# Altium schematic sheet STM32_MCU.SchDoc
size A; SheetNumber: 3; SheetTotal: 4
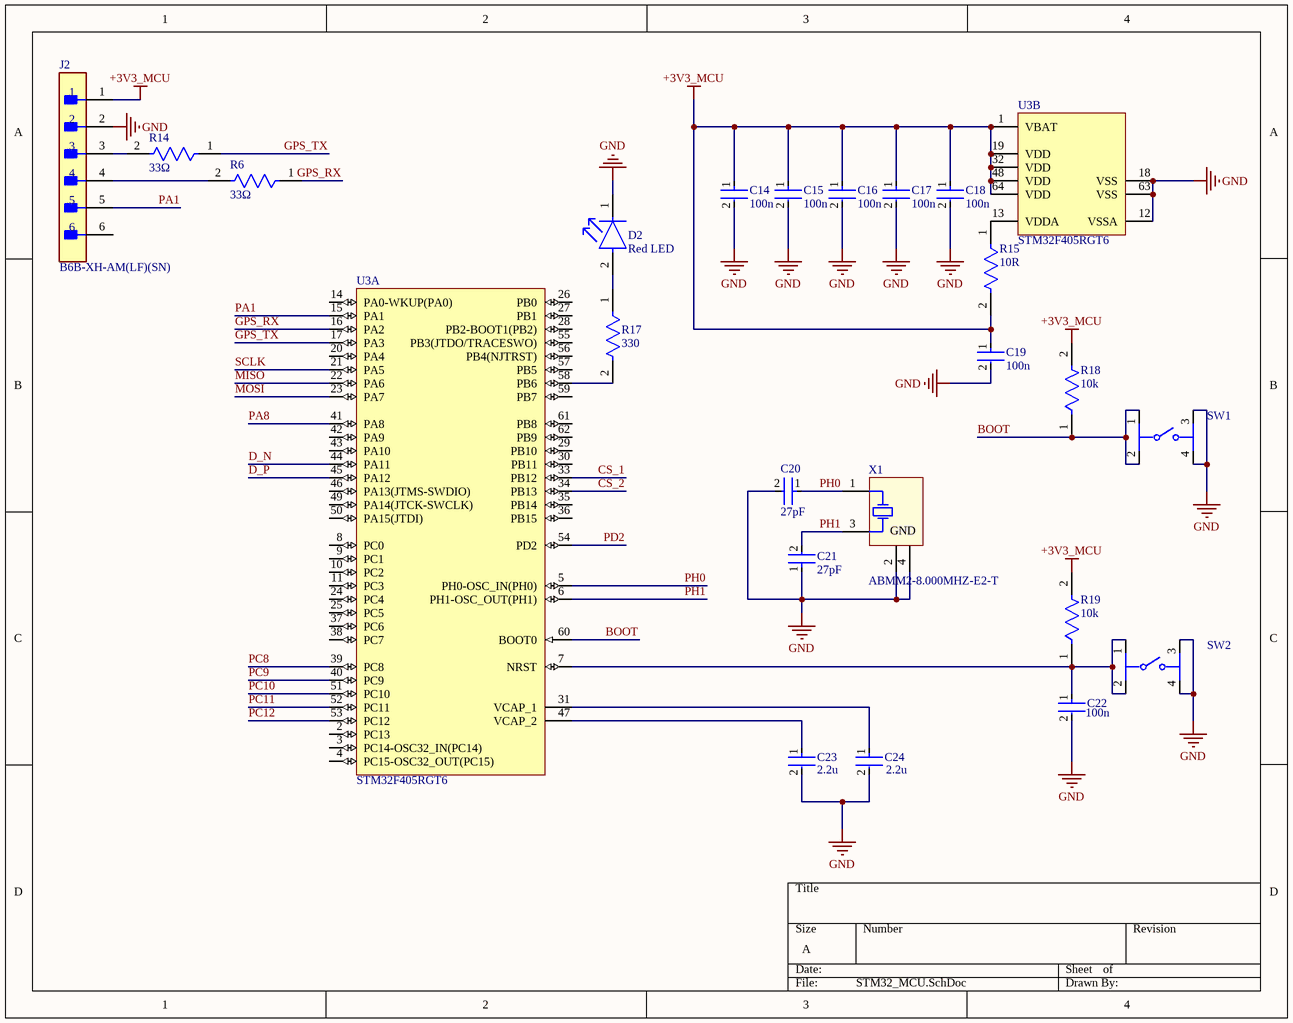
[diagram p0: STM32_MCU.SchDoc]

## Parts
C14  Capacitance: 100n  [FP-0603B104K250CT-IPC_C]  (hidden comment: 0603B104K250CT)
C15  Capacitance: 100n  [FP-0603B104K250CT-IPC_C]  (hidden comment: 0603B104K250CT)
C16  Capacitance: 100n  [FP-0603B104K250CT-IPC_C]  (hidden comment: 0603B104K250CT)
C17  Capacitance: 100n  [FP-0603B104K250CT-IPC_C]  (hidden comment: 0603B104K250CT)
C18  Capacitance: 100n  [FP-0603B104K250CT-IPC_C]  (hidden comment: 0603B104K250CT)
C19  Capacitance: 100n  [FP-0603B104K250CT-IPC_C]  (hidden comment: 0603B104K250CT)
C20  Capacitance: 27pF  [FP-CL934-IPC_C]  (hidden comment: CL05C270JB5NNNC)
C21  Capacitance: 27pF  [FP-CL934-IPC_C]  (hidden comment: CL05C270JB5NNNC)
C22  Capacitance: 100n  [FP-0603B104K250CT-IPC_C]  (hidden comment: 0603B104K250CT)
C23  Capacitance: 2.2u  [FP-CL10-IPC_A]  (hidden comment: CL10A225KO8NNNC)
C24  Capacitance: 2.2u  [FP-CL10-IPC_A]  (hidden comment: CL10A225KO8NNNC)
D2  Red LED  [FP-LTST-S270KRKT-MFG]
J2  B6B-XH-AM(LF)(SN)  [FP-B6B-XH-AM_LF_SN-MFG]
R6  value 33Ω  [FP-SR0603-MFG]  (hidden comment: SR0603FR-7T33RL)
R14  value 33Ω  [FP-SR0603-MFG]  (hidden comment: SR0603FR-7T33RL)
R15  Resistance: 10R  [FP-AF0603-IPC_C]  (hidden comment: AF0603JR-0710RL)
R17  Resistance: 330  [FP-RT0603-MFG]  (hidden comment: RT0603FRD07330RL)
R18  value 10k  [FP-AC0603-IPC_A]  (hidden comment: AC0603JR-7W10KL)
R19  value 10k  [FP-AC0603-IPC_A]  (hidden comment: AC0603JR-7W10KL)
SW1  PTS526SK15SMTR2LFS  [FP-PTS526SK15SMTR2LFS-MFG]  (value not drawn)
SW2  PTS526SK15SMTR2LFS  [FP-PTS526SK15SMTR2LFS-MFG]  (value not drawn)
U3  STM32F405RGT6  [STM-LQFP64_M]  (parts A,B of 2)
X1  ABMM2-8.000MHZ-E2-T  [ABRA-ABMM2-4_V]

## Nets
+3V3_MCU: C14.1 C15.1 C16.1 C17.1 C18.1 C19.1 J2.1 R15.2 R18.2 R19.2 U3.1(VBAT) U3.19(VDD) U3.32(VDD) U3.48(VDD) U3.64(VDD)
GND: C14.2 C15.2 C16.2 C17.2 C18.2 C19.2 C20.2 C21.1 C22.2 C23.2 C24.2 D2.1(C) J2.2 SW1.3 SW1.4 SW2.3 SW2.4 U3.12(VSSA) U3.18(VSS) U3.63(VSS) X1.2(GND) X1.4(GND)
BOOT: R18.1 SW1.1 SW1.2 U3.60(BOOT0)
CS_1: U3.33(PB12)
CS_2: U3.34(PB13)
D_N: U3.44(PA11)
D_P: U3.45(PA12)
GPS_RX: R6.1 U3.16(PA2)
GPS_TX: R14.1 U3.17(PA3)
MISO: U3.22(PA6)
MOSI: U3.23(PA7)
PA1: J2.5 U3.15(PA1)
PA8: U3.41(PA8)
PC8: U3.39(PC8)
PC9: U3.40(PC9)
PC10: U3.51(PC10)
PC11: U3.52(PC11)
PC12: U3.53(PC12)
PD2: U3.54(PD2)
PH0: C20.1 U3.5(PH0-OSC_IN(PH0)) X1.1(X1)
PH1: C21.2 U3.6(PH1-OSC_OUT(PH1)) X1.3(X2)
SCLK: U3.21(PA5)
NetC22_1: C22.1 R19.1 SW2.1 SW2.2 U3.7(NRST)
NetC23_1: C23.1 U3.47(VCAP_2)
NetC24_1: C24.1 U3.31(VCAP_1)
NetD2_2: D2.2(A) R17.1
NetJ2_3: J2.3 R14.2
NetJ2_4: J2.4 R6.2
NetR15_1: R15.1 U3.13(VDDA)
NetR17_2: R17.2 U3.58(PB6)

Not connected (* = marked no-connect by the designer): J2 6; U3 2(PC13) 3(PC14-OSC32_IN(PC14)) 4(PC15-OSC32_OUT(PC15)) 8(PC0) 9(PC1) 10(PC2) 11(PC3) 14(PA0-WKUP(PA0)) 20(PA4) 24(PC4) 25(PC5) 26(PB0) 27(PB1) 28(PB2-BOOT1(PB2)) 29(PB10) 30(PB11) 35(PB14) 36(PB15) 37(PC6) 38(PC7) 42(PA9) 43(PA10) 46(PA13(JTMS-SWDIO)) 49(PA14(JTCK-SWCLK)) 50(PA15(JTDI)) 55(PB3(JTDO/TRACESWO)) 56(PB4(NJTRST)) 57(PB5) 59(PB7) 61(PB8) 62(PB9)

## Library data of the parts
C14-C19 C22 = CMP-45632-000009-1: CAP CER 0.1UF 25V X7R 0603; Tolerance: 10%; Voltage Rating (DC): 25V; Dielectric: X7R; Packaging: Tape and Reel; RoHS Compliant: Yes; Case Code (Imperial): 0603; Depth: 0.8mm; Voltage Rating: 25V; Case Code (Metric): 1608; Lead Free: Lead Free; Min Operating Temperature: -55°C; Max Operating Temperature: 125°C; Length: 1.6mm; Case/Package: Ceramic; Radiation Hardening: No
C20 C21 = CMP-13271-002092-1: Cap Ceramic 27pF 50V C0G ±5% SMD 0402 +125°C Paper T/R; Temperature Coefficient: 300ppm/°C; Dielectric: C0G; Contact Plating: Tin; Width: 0.02inch; Radiation Hardening: No; Voltage Rating (DC): 50V; Material: Ceramic; Case Code (Metric): 1005; Max Operating Temperature: 125°C; Min Operating Temperature: -55°C; Tolerance: 5%; Case Code (Imperial): 0402; Packaging: Tape and Reel; Lead Free: Lead Free; Depth: 0.5mm; Case/Package: 0402; Package Quantity: 1; Height: 0.5mm; Voltage Rating: 50V; Length: 1mm; Mount: Surface Mount; Thickness: 0.022inch; Voltage: 50V
C23 C24 = CMP-13271-000835-1: Cap Ceramic 2.2uF 16V X5R ±10% Pad SMD 0603 +85°C T/R; Case Code (Metric): 1608; Height: 0.8mm; Case/Package: 0603; Depth: 0.8mm; Voltage Rating: 16V; Case Code (Imperial): 0603; Length: 1.6mm; Packaging: Tape and Reel; Material: Ceramic; Lead Free: Lead Free; Max Operating Temperature: 85°C; Contact Plating: Tin; Thickness: 0.035inch; Radiation Hardening: No; Tolerance: 10%; Min Operating Temperature: -55°C; Voltage: 16V; Dielectric: X5R; Mount: Surface Mount; Package Quantity: 4000; Width: 0.031inch; Voltage Rating (DC): 16V
D2 = CMP-2000-06630-2: LED RED CLEAR CHIP SMD R/A / LTST-S270KRKT; Test Current: 20mA; Number of LEDs: 1; Power Rating: 75mW; Lens Style: Diffused; Luminous Intensity: 54mcd; Wavelength: 639nm; Dominant Wavelength: 631nm; Lens Color: Colorless; Forward Voltage: 2V; Viewing Angle: 130°; Forward Current: 30mA; Reverse Voltage: 5V; Illumination Color: Red; Case Code (Imperial): 0603; Color: Red; Packaging: Tape and Reel; Number of Pins: 2; Length: 1.6mm; Lens Transparency: Clear; Width: 1.15mm; Power Dissipation: 75mW; Lead Free: Lead Free; Max Power Dissipation: 75mW; Case/Package: 0603; Max Operating Temperature: 85°C; Mount: Surface Mount; Depth: 0.6mm; Number of Elements: 1; Radiation Hardening: No; Case Code (Metric): 1608; Package Quantity: 1; Height: 0.6mm; Min Operating Temperature: -55°C
J2 = CMP-17439-000167-1: CONN HEADER VERT 6POS 2.5MM; Shape: Straight; Current Rating: 3A; Mated Stacking Heights: 9.8mm; Number of Positions: 6; Voltage Rating: 250V; Pitch: 2.5mm; Insulation Color: Natural; Number of Pins: 6; Width: 5.75mm; Flammability Rating: UL94 V-0; Packaging: Bulk; Connector Type: Header; Number of Rows: 1; Contact Plating: Copper; Mount: Through Hole; Min Operating Temperature: -25°C; Contact Type: Male Pin; Contact Shape: Square; Fastening Type: Detent; Length: 17.4mm; Series: XH; Contact Finish - Mating: TIN; Max Operating Temperature: 85°C; Insulation Material: Nylon; Number of Poles: 6; Termination: Press-Fit; Contact Material: Brass; Height: 7mm
R6 R14 = CMP-03412-011068-1: RES 33 OHM 1% 1/4W 0603; Manufacturer: Yageo; Automotive Grade: Grade 0; Voltage Rating: 75V; Power Rating: 0.25W; Tolerance: 0.01; ComponentLink2Description: Datasheet; Device Class L1: Passive Components; Package: SR0603; Temperature: -55°C to +155°C; Composition: Thick Film; RoHS: TRUE; Resistance: 33Ω; Ipc Land Pattern Name: RESC16080X45; Automotive: Yes; Temperature Range Low: -55°C; Height: 0.55mm; Category: Res; Digikey Description: RES 33 OHM 1% 1/4W 0603; Manufacturer Part Number: SR0603FR-7T33RL; Series: SR; ComponentLink2URL: http://www.yageo.com/documents/recent/PYu-SR_D_F%20tol_RoHS_L_3.pdf; Device Class L2: Resistors; Temperature Range High: +155°C; Device Class L3: Chip SMD Resistors; Octopart: https://octopart.com/sr0603fr-7t33rl-yageo-92673856; Footprint Url: http://www.yageo.com/exep/pages/download/literatures/PYu-R_Mount_10.pdf; Lead Free: Yes
R15 = CMP-03412-044872-1: Anti-Sulfurated Chip Resistors Automotive Grade 10Ω 5% 200ppm/°C 0603; Max Power Dissipation: 100mW; Features: Moisture Resistant; Resistor Type: Thick Film; Series: AF; Width: 0.031inch; Number of Terminations: 2; Temperature Coefficient: 200ppm/°C; Min Operating Temperature: -55°C; RoHS Compliant: Yes; Packaging: Tape and Reel; Height: 0.022inch; Max Operating Temperature: 155°C; Case/Package: 0603; Tolerance: 5%; Length: 0.063inch
R17 = CMP-03412-025644-1: RES SMD 330 OHM 1% 1/10W 0603; Manufacturer: Yageo; Tolerance: 0.01; Power Rating: 0.1W; Temperature Coefficient: 25 ppm/°C; Voltage Rating: 75V; Value: 330Ω; Description: RT0603 330Ω 0.1W 25 ppm/°C 1.00%; Octopart: https://octopart.com/rt0603frd07330rl-yageo-71395358; Temperature: -55°C to +155°C; Height: 0.55mm; Temperature Range Low: -55°C; Category: Res; Manufacturer Part Number: RT0603FRD07330RL; Ipc Land Pattern Name: RESC16080X45; Device Class L1: Passive Components; ComponentLink2Description: Datasheet; Temperature Range High: +155°C; RoHS: TRUE; Footprint Url: http://www.yageo.com/exep/pages/download/literatures/PYu-R_Mount_10.pdf; ComponentLink2URL: http://www.yageo.com/documents/recent/PYu-RT_1-to-0.01_RoHS_L_9.pdf; Automotive: No; Device Class L3: Chip SMD Resistors; Series: RT; Composition: Thin Film; Device Class L2: Resistors; Digikey Description: RES SMD 330 OHM 1% 1/10W 0603; Package: RT0603; Lead Free: Yes
R18 R19 = CMP-03412-040683-1: RES 10kΩ 5.00% 0.2W 0603
SW1 SW2 = CMP-10040-000013-1: TACT 5.2 X 5.2, 1.5 MM H, 260GF,; Manufacturer: C&K; Operating Force: 250gf; Throw Configuration: SPST-NO; Contact Current Rating: 50mA; Standoff Height: 0mm; Contact Resistance: 100mΩ; Voltage Rating Dc: 12V; Electromechanical Life: 200000Cycles; Device Class L3: Tactile Switches; Device Class L2: Switches; Temperature: -20°C to +70°C; Temperature Range Low: -20°C; Package: PTS526SK15SMTR2LFS; Temperature Range High: +70°C; ComponentLink2Description: Datasheet; Device Class L1: Electromechanical; Height: 1.65mm; Digikey Description: TACT 5.2 X 5.2, 1.5 MM H, 260GF,; Category: Switch; RoHS: TRUE; Automotive: No; Lead Free: Yes; Manufacturer Part Number: PTS526SK15SMTR2LFS; Octopart: https://octopart.com/pts526+sk15+smtr2+lfs-c%26k+components-100617999; ComponentLink2URL: https://www.ckswitches.com/media/2780/pts526.pdf
U3 = CMP-0243-00019-3: ARM Cortex-M4 32-bit MCU+FPU, 210 DMIPS, 1024 kB Flash, 192 kB Internal RAM, 51 I/Os, 64-pin LQFP, -40 to 85 degC, Tray; Manufacturer: STMicroelectronics; Supply Voltage(Vcc) min (V): 1.8; Supply Voltage(Vcc) max (V): 3.6; Internal RAM Size (kB): 192; I/Os (High Current): 51; D/A Converter: 2x12-bit; FLASH Size (Prog) (kB): 1024; Operating Frequency(F) (Processor speed) (MHz): 168; ComponentLink2Description: Datasheet; PackageVersion: Rev. 4, 06/2013; DatasheetVersion: Rev. 4; Core: ARM Cortex-M4; ComponentLink2URL: http://www.st.com/st-web-ui/static/active/en/resource/technical/document/datasheet/DM00037051.pdf; PackageReference: LQFP64; Packing: Tray; ComponentLink1Description: Manufacturer URL; ComponentLink3URL: http://www.st.com/st-web-ui/static/active/en/resource/technical/document/datasheet/DM00037051.pdf; ComponentLink3Description: Package Specification; Mounting Technology: Surface Mount; ComponentLink1URL: http://www.st.com/web/en/home.html; PackageDescription: 64-Pin Low Profile Quad Flat Package, 10 x 10 mm Body, 0.5 mm Pitch; PartNumber: STM32F405RGT6
X1 = CMP-0277-00003-1: Ceramic Surface Mount Low Profile Quartz Crystal, 8 MHz, -20 to 70 degC, 4-Pin 6 x 3.6 x 1.2 mm SMD, RoHS, 1000pcs / Reel; Manufacturer: Abracon; ESR: 72 Ohm Max.; Frequency: 8 MHz; Shunt Capacitance C0: 7 pF Max.; Load Capacitance CL: 18 pF Typ.; ComponentLink3Description: Package Specification; PackageDescription: 4-Pin SMD, Body 6 x 3.6 mm, Pitch 4.4 mm; DatasheetVersion: Jan-13; ComponentLink1URL: http://www.abracon.com/; ComponentLink2URL: http://www.abracon.com/Resonators/ABMM2.pdf; Temperature Range: -20 to 70 degC; Mounting Technology: Surface Mount; RoHS: TRUE; PartNumber: ABMM2-8.000MHZ-E2-T; ComponentLink2Description: Datasheet; ComponentLink3URL: http://www.abracon.com/Resonators/ABMM2.pdf; ComponentLink1Description: Manufacturer URL; Packing: 1000pcs / Reel